# EAGLE design LB_BIT_CLOUD-v03(1_1x) (EAGLE 6.5.0)
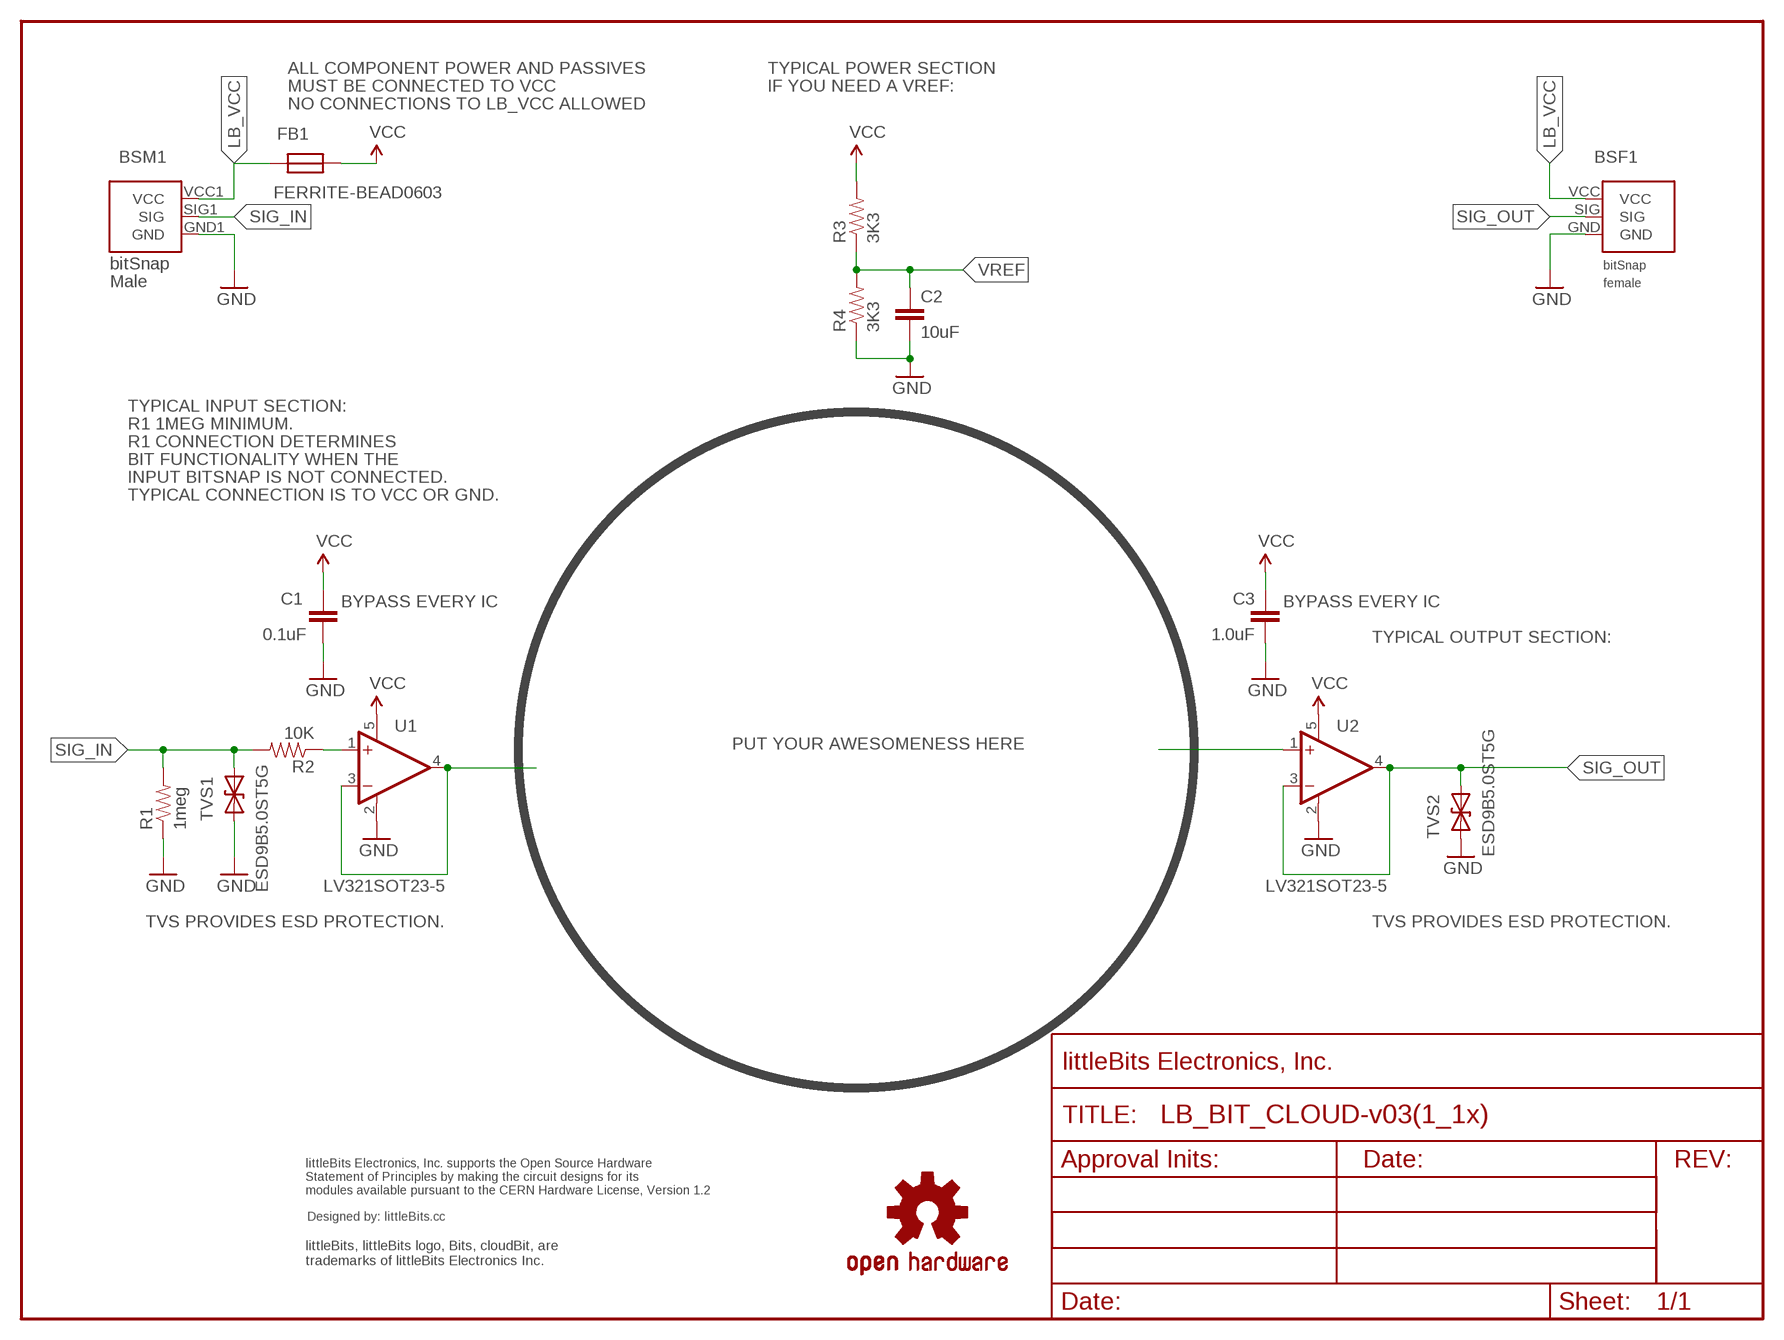
[diagram p0: schematic, sheet 1]

## Parts
BSF1  BITSNAP_V03_FEMALE  [BITSNAP_V03_FEMALE]
BSM1  BITSNAP_V03_MALE  [BITSNAP_V03_MALE]
C1  0.1uF  CAPCAP-0603  [CAP-0603]
C2  10uF  CAPCAP-0603  [CAP-0603]
C3  1.0uF  CAPCAP-0603  [CAP-0603]
FB1  FERRITE-BEAD0603  [R0603]
FRAME1  FRAME-LETTER  [FABDWG01-OHW]
R1  1meg  RESISTOR0603  [RES-0603]
R2  10K  RESISTOR0603  [RES-0603]
R3  3K3  RESISTOR0603  [RES-0603]
R4  3K3  RESISTOR0603  [RES-0603]
TVS1  ESD9B5.0ST5G  DIODE-TVSSOD-923  [SOD-923]
TVS2  ESD9B5.0ST5G  DIODE-TVSSOD-923  [SOD-923]
U1  LV321SOT23-5  [SOT23-5]
U2  LV321SOT23-5  [SOT23-5]
U$3  OSHWCREDIT  [OSHWCREDIT]
U$4  OSHW-LOGOL  [OSHW-LOGO-L]

## Nets
GND: BSF1.GND BSM1.GND1(GND) C1.2 C2.2 C3.1 R1.1 R4.1 TVS1.1(A) TVS2.1(A) U1.2(V-) U2.2(V-)
LB_VCC: BSF1.VCC BSM1.VCC1(VCC) FB1.2
N$2: U1.3(-IN) U1.4(OUT)
N$3: U2.1(+IN)
N$4: R2.1 U1.1(+IN)
SIG_IN: BSM1.SIG1(SIG) R1.2 R2.2 TVS1.2(C)
SIG_OUT: BSF1.SIG TVS2.2(C) U2.3(-IN) U2.4(OUT)
VCC: C1.1 C3.2 FB1.1 R3.2 U1.5(V+) U2.5(V+)
VREF: C2.1 R3.1 R4.2

## Notes on the sheet
- ALL COMPONENT POWER AND PASSIVES | TYPICAL POWER SECTION
- MUST BE CONNECTED TO VCC | IF YOU NEED A VREF:
- NO CONNECTIONS TO LB_VCC ALLOWED
- TYPICAL INPUT SECTION:
- R1 1MEG MINIMUM.
- R1 CONNECTION DETERMINES
- BIT FUNCTIONALITY WHEN THE
- INPUT BITSNAP IS NOT CONNECTED.
- TYPICAL CONNECTION IS TO VCC OR GND.
- BYPASS EVERY IC | BYPASS EVERY IC
- TYPICAL OUTPUT SECTION:
- PUT YOUR AWESOMENESS HERE
- TVS PROVIDES ESD PROTECTION. | TVS PROVIDES ESD PROTECTION.

## Library data of the parts
BSF1 = bitSnap:BITSNAP_V03_FEMALE
BSM1 = bitSnap:BITSNAP_V03_MALE
C1-C3 = LITTLEBITS:CAP
FB1 = LITTLEBITS:FERRITE-BEAD
FRAME1 = LITTLEBITS:FRAME-LETTER
R1-R4 = LITTLEBITS:RESISTOR
TVS1 TVS2 = LITTLEBITS:DIODE-TVS: Bidirectional Transient Voltage Suppression Diode: Device conducts in avalanche mode after reaching a part dependent voltage threshold. Used for limiting voltage spikes on ESD sensitive inputs and outputs.; IEC_ESD_PROT0: +/-18kV; LB_PN: ?; MPN: ESD9B5.0ST5G; V_CLAMP: ?; V_OPERATION: 5V
U1 U2 = LITTLEBITS:LV321
U$3 = LITTLEBITS:OSHWCREDIT
U$4 = SparkFun_NEW:OSHW-LOGO: Open Source Hardware Logo This logo indicates the piece of hardware it is found on incorporates a OSHW license and/or adheres to the definition of open source hardware found here: http://freedomdefined.org/OSHW

## Board
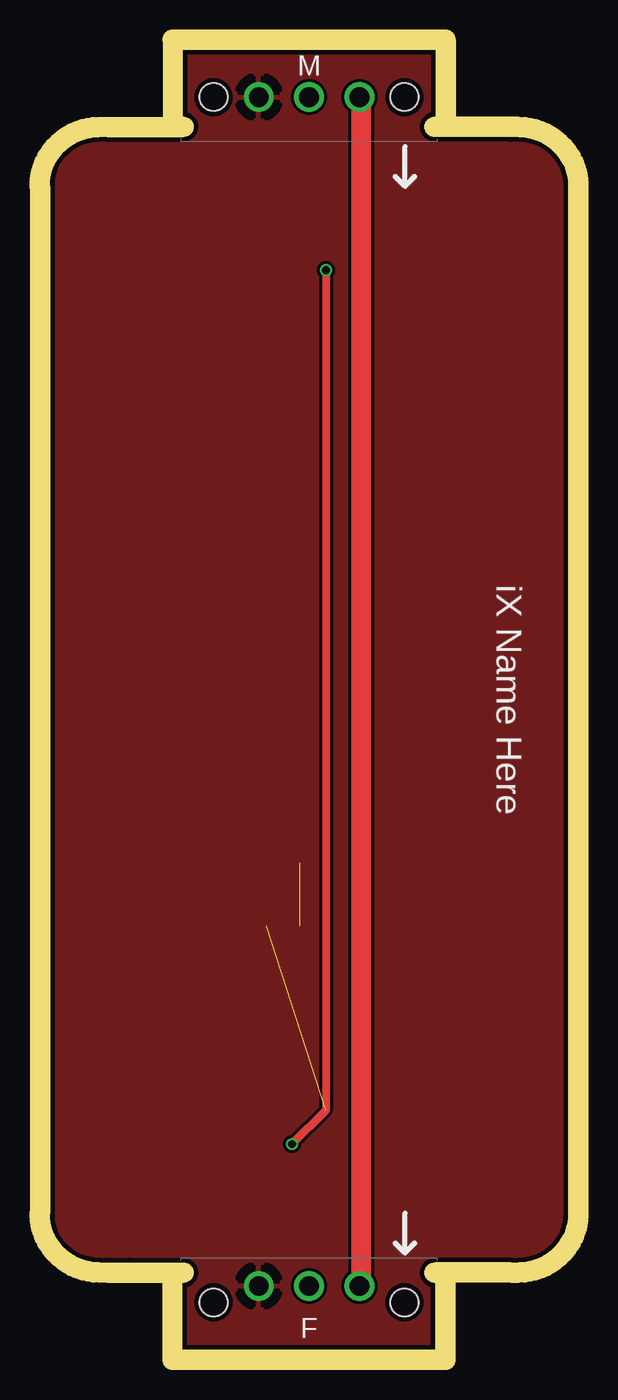
[diagram p1: board, top side]
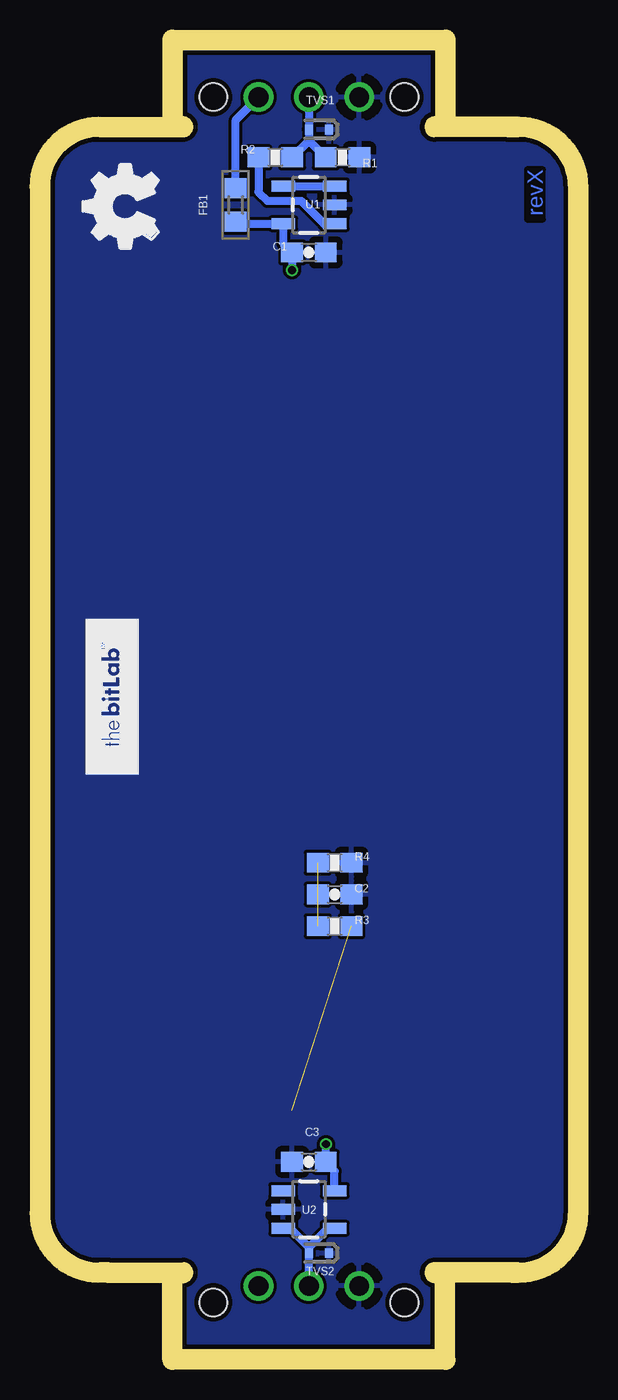
[diagram p2: board, bottom side, seen from below]

Size 26.2 x 65.63 mm. Coordinates in mm from the lower left corner, seen from the top.
Outline: 23.2,61.23 23.7,61.23 arc-90 26.2,58.73 26.2,6.9 arc-90 23.7,4.4 23.2,4.4
Outline: 3.1,61.23 2.5,61.23 arc90 0,58.73 0,6.9 arc90 2.5,4.4 4,4.4
Copper layers (1*2+3*14+15*16): Top 0.035mm / dielectric 0.13mm / Route2 0.035mm / dielectric 0.6mm / Route3 0.035mm / dielectric 0.13mm / Route14 0.035mm / dielectric 0.6mm / Route15 0.035mm / dielectric 0.13mm / Bottom 0.035mm
Design rules "littleBits6-LAYERDRC": minimum track width 5mil, minimum drill 10mil, track to track 0.15mm, track to pad 0.15mm, pad to pad 0.15mm, via to via 0.15mm, smd to smd 1mil, copper to edge 10mil, drill to drill 8mil, minimum pad ring 5mil, minimum via ring 4mil, stop-mask expansion 4mil, vias tented up to drill 25mil, thermal gap 12mil
Milling: 10 lines

### Footprints (pad centres in the part's own frame; a part is rotated, then mirrored left to right if it is on the bottom)
BITSNAP_V03_FEMALE = drill 1: GND 4.065,3.44; SIG 6.605,3.44; VCC 9.145,3.44 | hole 1.4: 1.785,2.61; 11.425,2.61
BITSNAP_V03_MALE = drill 1: GND1 9.145,2.61; SIG1 6.605,2.61; VCC1 4.065,2.61 | hole 1.4: 1.785,2.61; 11.425,2.61
CAP-0603 = smd 1.1 x 1: 1 -0.85,0; 2 0.85,0
R0603 = smd 1 x 1.1: 1 -0.85,0; 2 0.85,0
RES-0603 = smd 1.1 x 1: 1 -0.85,0; 2 0.85,0
SOD-923 = smd 0.4 x 0.5: 1 -0.5,0; 2 0.5,0
SOT23-5 = smd 0.55 x 1.2: 1 -0.95,-1.3; 2 0,-1.3; 3 0.95,-1.3; 4 0.95,1.3; 5 -0.95,1.3

### Placement (x,y rotation side)
BSF1  6.5,-0.21 0 top
BSM1  19.71,65.84 180 top
C1  13.1,55.39 0 bottom
C2  11.8,22.99 0 bottom
C3  13.1,9.49 0 bottom
FB1  16.8,57.79 90 bottom
FRAME1  6.5,-0.21 0 top
R1  11.4,60.19 180 bottom
R2  14.8,60.19 0 bottom
R3  11.8,21.39 0 bottom
R4  11.8,24.59 180 bottom
TVS1  12.6,61.59 180 bottom
TVS2  12.6,4.89 180 bottom
U1  13.1,57.79 90 bottom
U2  13.1,7.09 270 bottom
U$1  [OSHW_FILLX150_NOTEXT]  20.7,55.59 90 bottom
U$2  [BITLAB-LOGO]  21.7,36.89 270 top
U$3  -81.64,-61.94 0 top  (outside the outline)
U$4  -21.7,-65.44 0 top  (outside the outline)

### Tracks (layer width: path | path; a pad name or v marks a point on that pad's centre or on a via)
GND
  pour Top: 0,65.79 0,-0.21 26.2,-0.21 26.2,65.79
  pour Bottom: 0,-0.21 0,65.79 24,65.79 26.2,65.79 26.2,0.29 26.2,-0.21
LB_VCC  (via drill 0.6)
  Top 1: v15.73,63.15 15.73,3.31 BSF1.VCC
  Bottom 0.406: FB1.2 16.8,62.07 v15.73,63.15 BSM1.VCC1
N$2
  Bottom 0.406: U1.4 U1.3
N$4
  Bottom 0.406: R2.1 15.65,58.44 15.2,57.99 13.5,57.99 12.35,56.84 U1.1
SIG_IN
  Bottom 0.406: BSM1.SIG1 TVS1.2 13.1,61.04 | 13.1,61.04 R2.2 | 13.1,61.04 R1.2
SIG_OUT
  Bottom 0.406: BSF1.SIG TVS2.2 13.1,5.19 | 13.1,5.19 14.05,6.14 U2.3 | 13.1,5.19 12.15,6.14 U2.4
VCC  (via drill 0.4)  (1 unrouted)
  Top 0.406: v13.95,54.49 13.95,12.09 v12.25,10.39
  Bottom 0.406: FB1.1 16.7,56.84 U1.5 14.4,55.84 C1.1 v13.95,54.49 | U2.5 11.8,9.04 C3.2 v12.25,10.39
VREF  (2 unrouted)

### Text on the board
Bottom: revX
tPlace: iX Name Here